# EAGLE design 2019SpaceAppsTrophy (EAGLE 9.5.0)
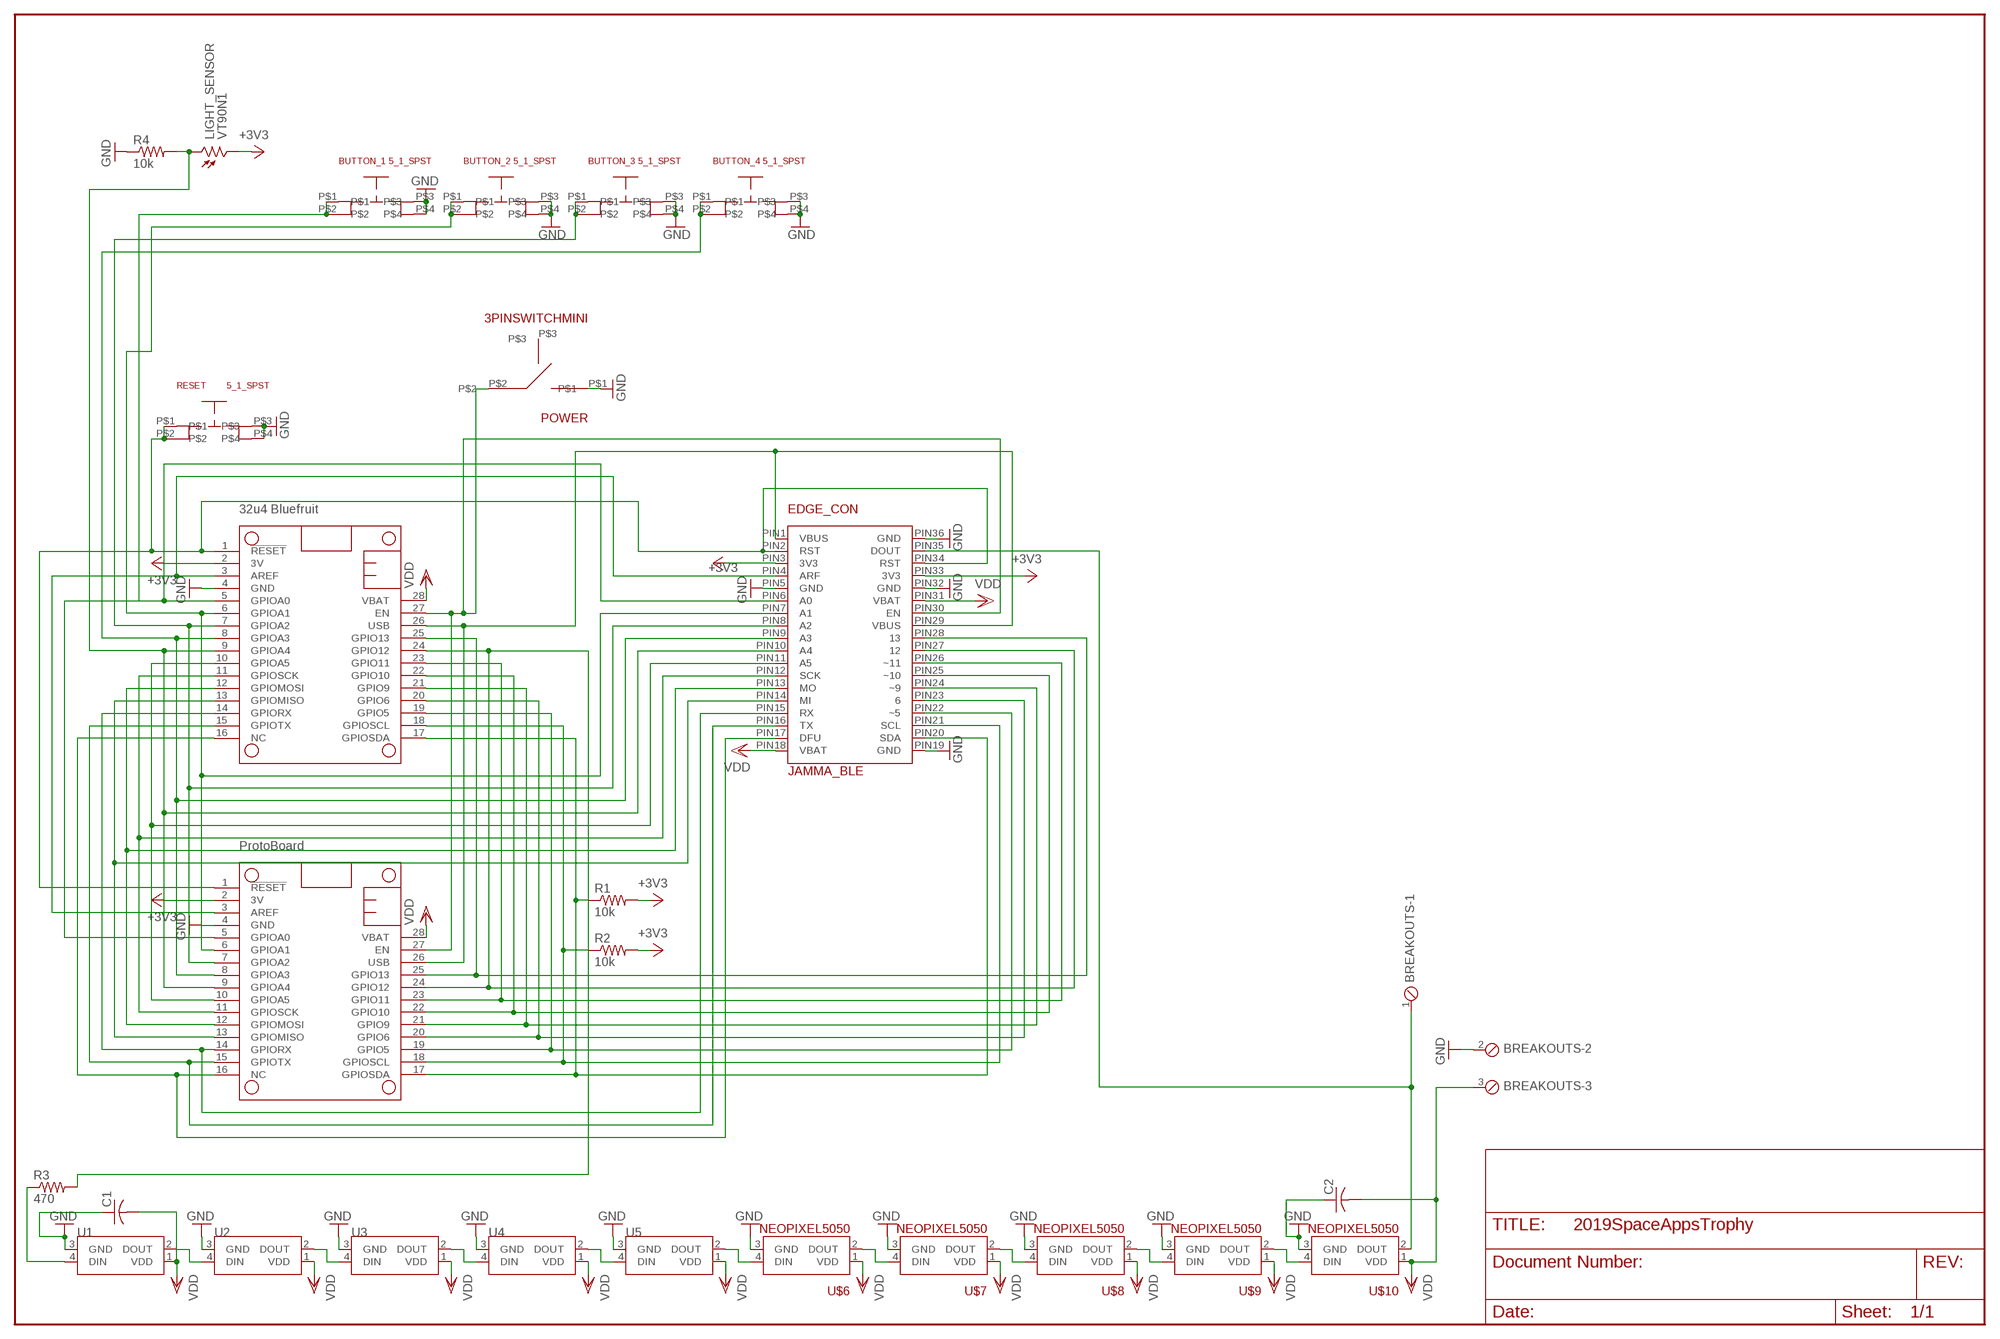
[diagram p0: schematic, sheet 1]

## Parts
BREAKOUTS  MPT3  [3POL254]
BUTTON_1  5_1_SPST  [5_1_SPST]
BUTTON_2  5_1_SPST  [5_1_SPST]
BUTTON_3  5_1_SPST  [5_1_SPST]
BUTTON_4  5_1_SPST  [5_1_SPST]
C1  C-USC0805  [C0805]
C2  C-USC0805  [C0805]
EDGE_CON  JAMMA_BLE  [JAMMA-28/56]
LIGHT_SENSOR  VT90N1  [VT900]
MS2  FEATHERWING  [FEATHERWING]
POWER  3PINSWITCHMINI  [3PINMINI]
PROTOBOARD  FEATHERWING  [FEATHERWING]
R1  10k  R-US_M0805  [M0805]
R2  10k  R-US_M0805  [M0805]
R3  470  R-US_M0805  [M0805]
R4  10k  R-US_M0805  [M0805]
RESET  5_1_SPST  [5_1_SPST]
U$1  NEOPIXEL5050  [NEOPIXEL5050]
U$2  NEOPIXEL5050  [NEOPIXEL5050]
U$3  NEOPIXEL5050  [NEOPIXEL5050]
U$4  NEOPIXEL5050  [NEOPIXEL5050]
U$5  NEOPIXEL5050  [NEOPIXEL5050]
U$6  NEOPIXEL5050  [NEOPIXEL5050]
U$7  NEOPIXEL5050  [NEOPIXEL5050]
U$8  NEOPIXEL5050  [NEOPIXEL5050]
U$9  NEOPIXEL5050  [NEOPIXEL5050]
U$10  NEOPIXEL5050  [NEOPIXEL5050]

## Nets
+3V3 [POWER]: EDGE_CON.PIN3(3V3) EDGE_CON.PIN33(3V3) LIGHT_SENSOR.2 MS2.2(3V) PROTOBOARD.2(3V) R1.2 R2.2
GND [POWER]: BREAKOUTS.2 BUTTON_1.P$3 BUTTON_1.P$4 BUTTON_2.P$3 BUTTON_2.P$4 BUTTON_3.P$3 BUTTON_3.P$4 BUTTON_4.P$3 BUTTON_4.P$4 C1.1 C2.1 EDGE_CON.PIN5(GND) EDGE_CON.PIN19(GND) EDGE_CON.PIN32(GND) EDGE_CON.PIN36(GND) MS2.4(GND) POWER.P$1 PROTOBOARD.4(GND) R4.1 RESET.P$3 RESET.P$4 U$1.3(GND) U$2.3(GND) U$3.3(GND) U$4.3(GND) U$5.3(GND) U$6.3(GND) U$7.3(GND) U$8.3(GND) U$9.3(GND) U$10.3(GND)
N$1: EDGE_CON.PIN17(DFU) MS2.16(NC) PROTOBOARD.16(NC)
N$2: EDGE_CON.PIN16(TX) MS2.15(GPIOTX) PROTOBOARD.15(GPIOTX)
N$3: EDGE_CON.PIN15(RX) MS2.14(GPIORX) PROTOBOARD.14(GPIORX)
N$4: EDGE_CON.PIN14(MI) MS2.13(GPIOMISO) PROTOBOARD.13(GPIOMISO)
N$5: EDGE_CON.PIN13(MO) MS2.12(GPIOMOSI) PROTOBOARD.12(GPIOMOSI)
N$6: U$7.2(DOUT) U$8.4(DIN)
N$7: EDGE_CON.PIN11(A5) MS2.10(GPIOA5) PROTOBOARD.10(GPIOA5)
N$8: EDGE_CON.PIN10(A4) LIGHT_SENSOR.1 MS2.9(GPIOA4) PROTOBOARD.9(GPIOA4) R4.2
N$9: BUTTON_4.P$1 BUTTON_4.P$2 EDGE_CON.PIN9(A3) MS2.8(GPIOA3) PROTOBOARD.8(GPIOA3)
N$10: BUTTON_3.P$1 BUTTON_3.P$2 EDGE_CON.PIN8(A2) MS2.7(GPIOA2) PROTOBOARD.7(GPIOA2)
N$11: BUTTON_2.P$1 BUTTON_2.P$2 EDGE_CON.PIN7(A1) MS2.6(GPIOA1) PROTOBOARD.6(GPIOA1)
N$12: BUTTON_1.P$1 BUTTON_1.P$2 EDGE_CON.PIN6(A0) MS2.5(GPIOA0) PROTOBOARD.5(GPIOA0)
N$13: EDGE_CON.PIN4(ARF) MS2.3(AREF) PROTOBOARD.3(AREF)
N$14: EDGE_CON.PIN2(RST) EDGE_CON.PIN34(RST) MS2.1(!RESET) PROTOBOARD.1(!RESET) RESET.P$1 RESET.P$2
N$15: U$8.2(DOUT) U$9.4(DIN)
N$16: EDGE_CON.PIN28 MS2.25(GPIO13) PROTOBOARD.25(GPIO13)
N$17: EDGE_CON.PIN27 MS2.24(GPIO12) PROTOBOARD.24(GPIO12) R3.2
N$18: EDGE_CON.PIN26(~11) MS2.23(GPIO11) PROTOBOARD.23(GPIO11)
N$19: EDGE_CON.PIN25(~10) MS2.22(GPIO10) PROTOBOARD.22(GPIO10)
N$20: EDGE_CON.PIN24(~9) MS2.21(GPIO9) PROTOBOARD.21(GPIO9)
N$21: EDGE_CON.PIN23 MS2.20(GPIO6) PROTOBOARD.20(GPIO6)
N$22: EDGE_CON.PIN22(~5) MS2.19(GPIO5) PROTOBOARD.19(GPIO5)
N$23: EDGE_CON.PIN21(SCL) MS2.18(GPIOSCL) PROTOBOARD.18(GPIOSCL) R2.1
N$24: EDGE_CON.PIN20(SDA) MS2.17(GPIOSDA) PROTOBOARD.17(GPIOSDA) R1.1
N$25: U$9.2(DOUT) U$10.4(DIN)
N$26: U$1.2(DOUT) U$2.4(DIN)
N$27: U$2.2(DOUT) U$3.4(DIN)
N$28: U$3.2(DOUT) U$4.4(DIN)
N$29: U$4.2(DOUT) U$5.4(DIN)
N$30: U$6.2(DOUT) U$7.4(DIN)
N$31: U$5.2(DOUT) U$6.4(DIN)
N$32: BREAKOUTS.1 EDGE_CON.PIN35(DOUT) U$10.2(DOUT)
N$33: EDGE_CON.PIN12(SCK) MS2.11(GPIOSCK) PROTOBOARD.11(GPIOSCK)
N$34: R3.1 U$1.4(DIN)
N$48: EDGE_CON.PIN30(EN) MS2.27(EN) POWER.P$2 PROTOBOARD.27(EN)
USB [POWER]: EDGE_CON.PIN1(VBUS) EDGE_CON.PIN29(VBUS) MS2.26(USB) PROTOBOARD.26(USB)
VDD [POWER]: BREAKOUTS.3 C1.2 C2.2 EDGE_CON.PIN18(VBAT) EDGE_CON.PIN31(VBAT) MS2.28(VBAT) PROTOBOARD.28(VBAT) U$1.1(VDD) U$2.1(VDD) U$3.1(VDD) U$4.1(VDD) U$5.1(VDD) U$6.1(VDD) U$7.1(VDD) U$8.1(VDD) U$9.1(VDD) U$10.1(VDD)
Unconnected: POWER.P$3

## Notes on the sheet
- 32u4 Bluefruit
- ProtoBoard
- U1 | U2 | U3 | U4 | U5

## Library data of the parts
BREAKOUTS = con-phoenix-254:MPT3: PHOENIX CONNECTOR; OC_FARNELL: unknown; OC_NEWARK: unknown
BUTTON_1-BUTTON_4 RESET = TrophyParts:5_1_SPST
C1 C2 = adafruit:C-US: CAPACITOR, American symbol
EDGE_CON = TrophyParts:JAMMA_BLE
LIGHT_SENSOR = TrophyParts:VT9: Photoconductive Cell VT900 Series Source: http://optoelectronics.perkinelmer.com/content/Datasheets/DTS_vt900seriesdatasheet.pdf
MS2 PROTOBOARD = TrophyParts:FEATHERWING
POWER = TrophyParts:3PINSWITCHMINI
R1-R4 = adafruit:R-US_: RESISTOR, American symbol
U$1-U$10 = TrophyParts:NEOPIXEL5050

## Net classes
1 POWER: width 0.508 mm
2 5V: width 0.508 mm

## Board
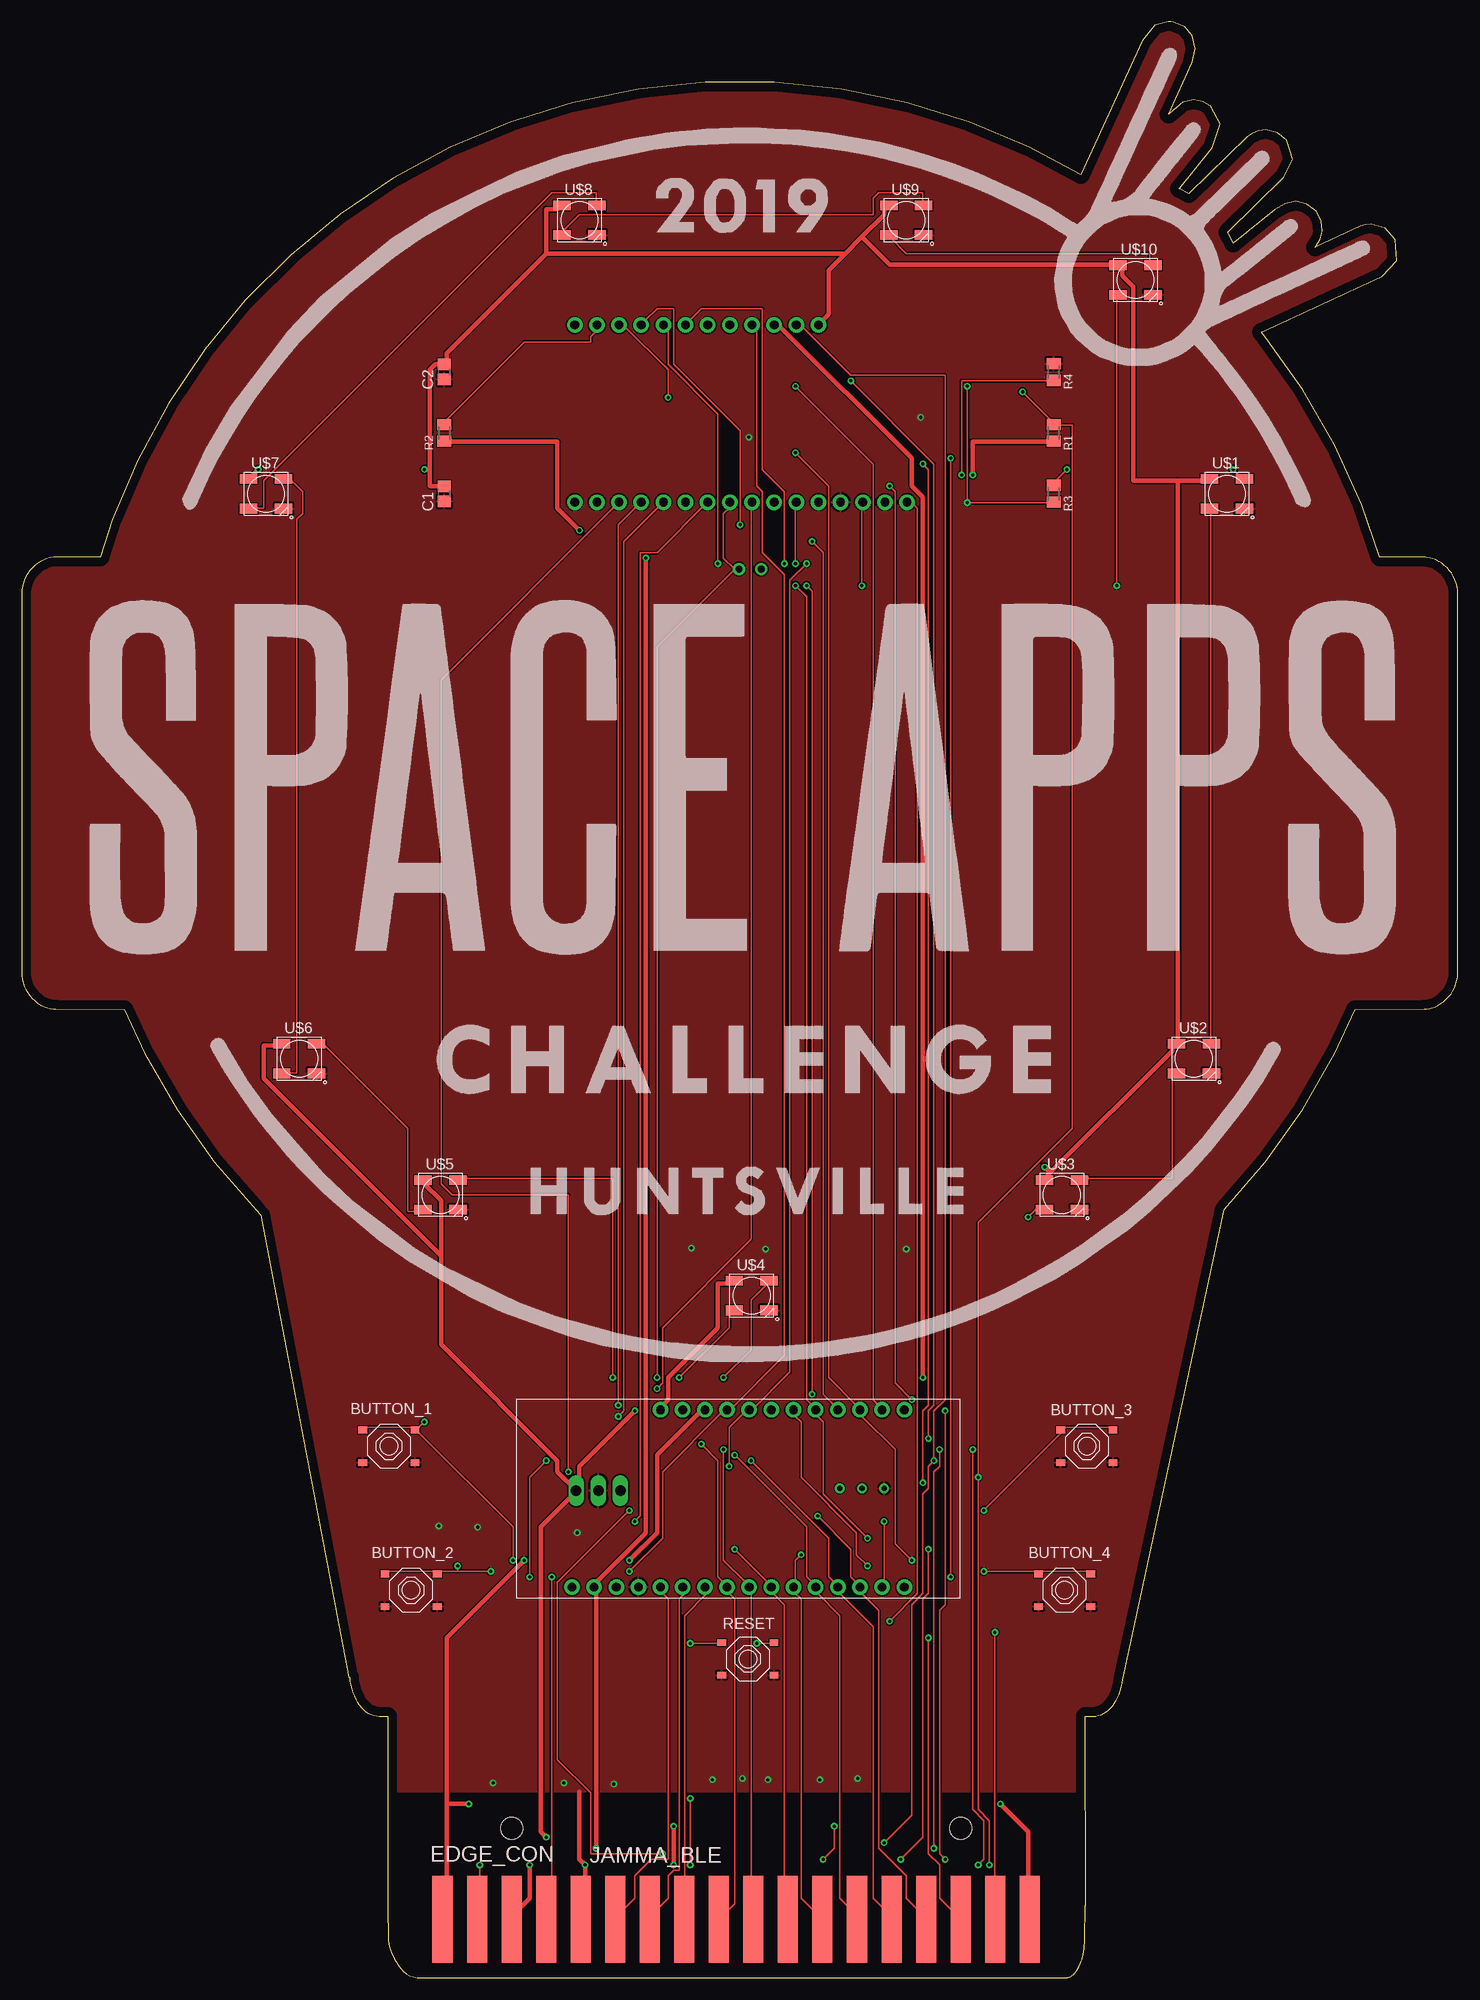
[diagram p1: board, top side]
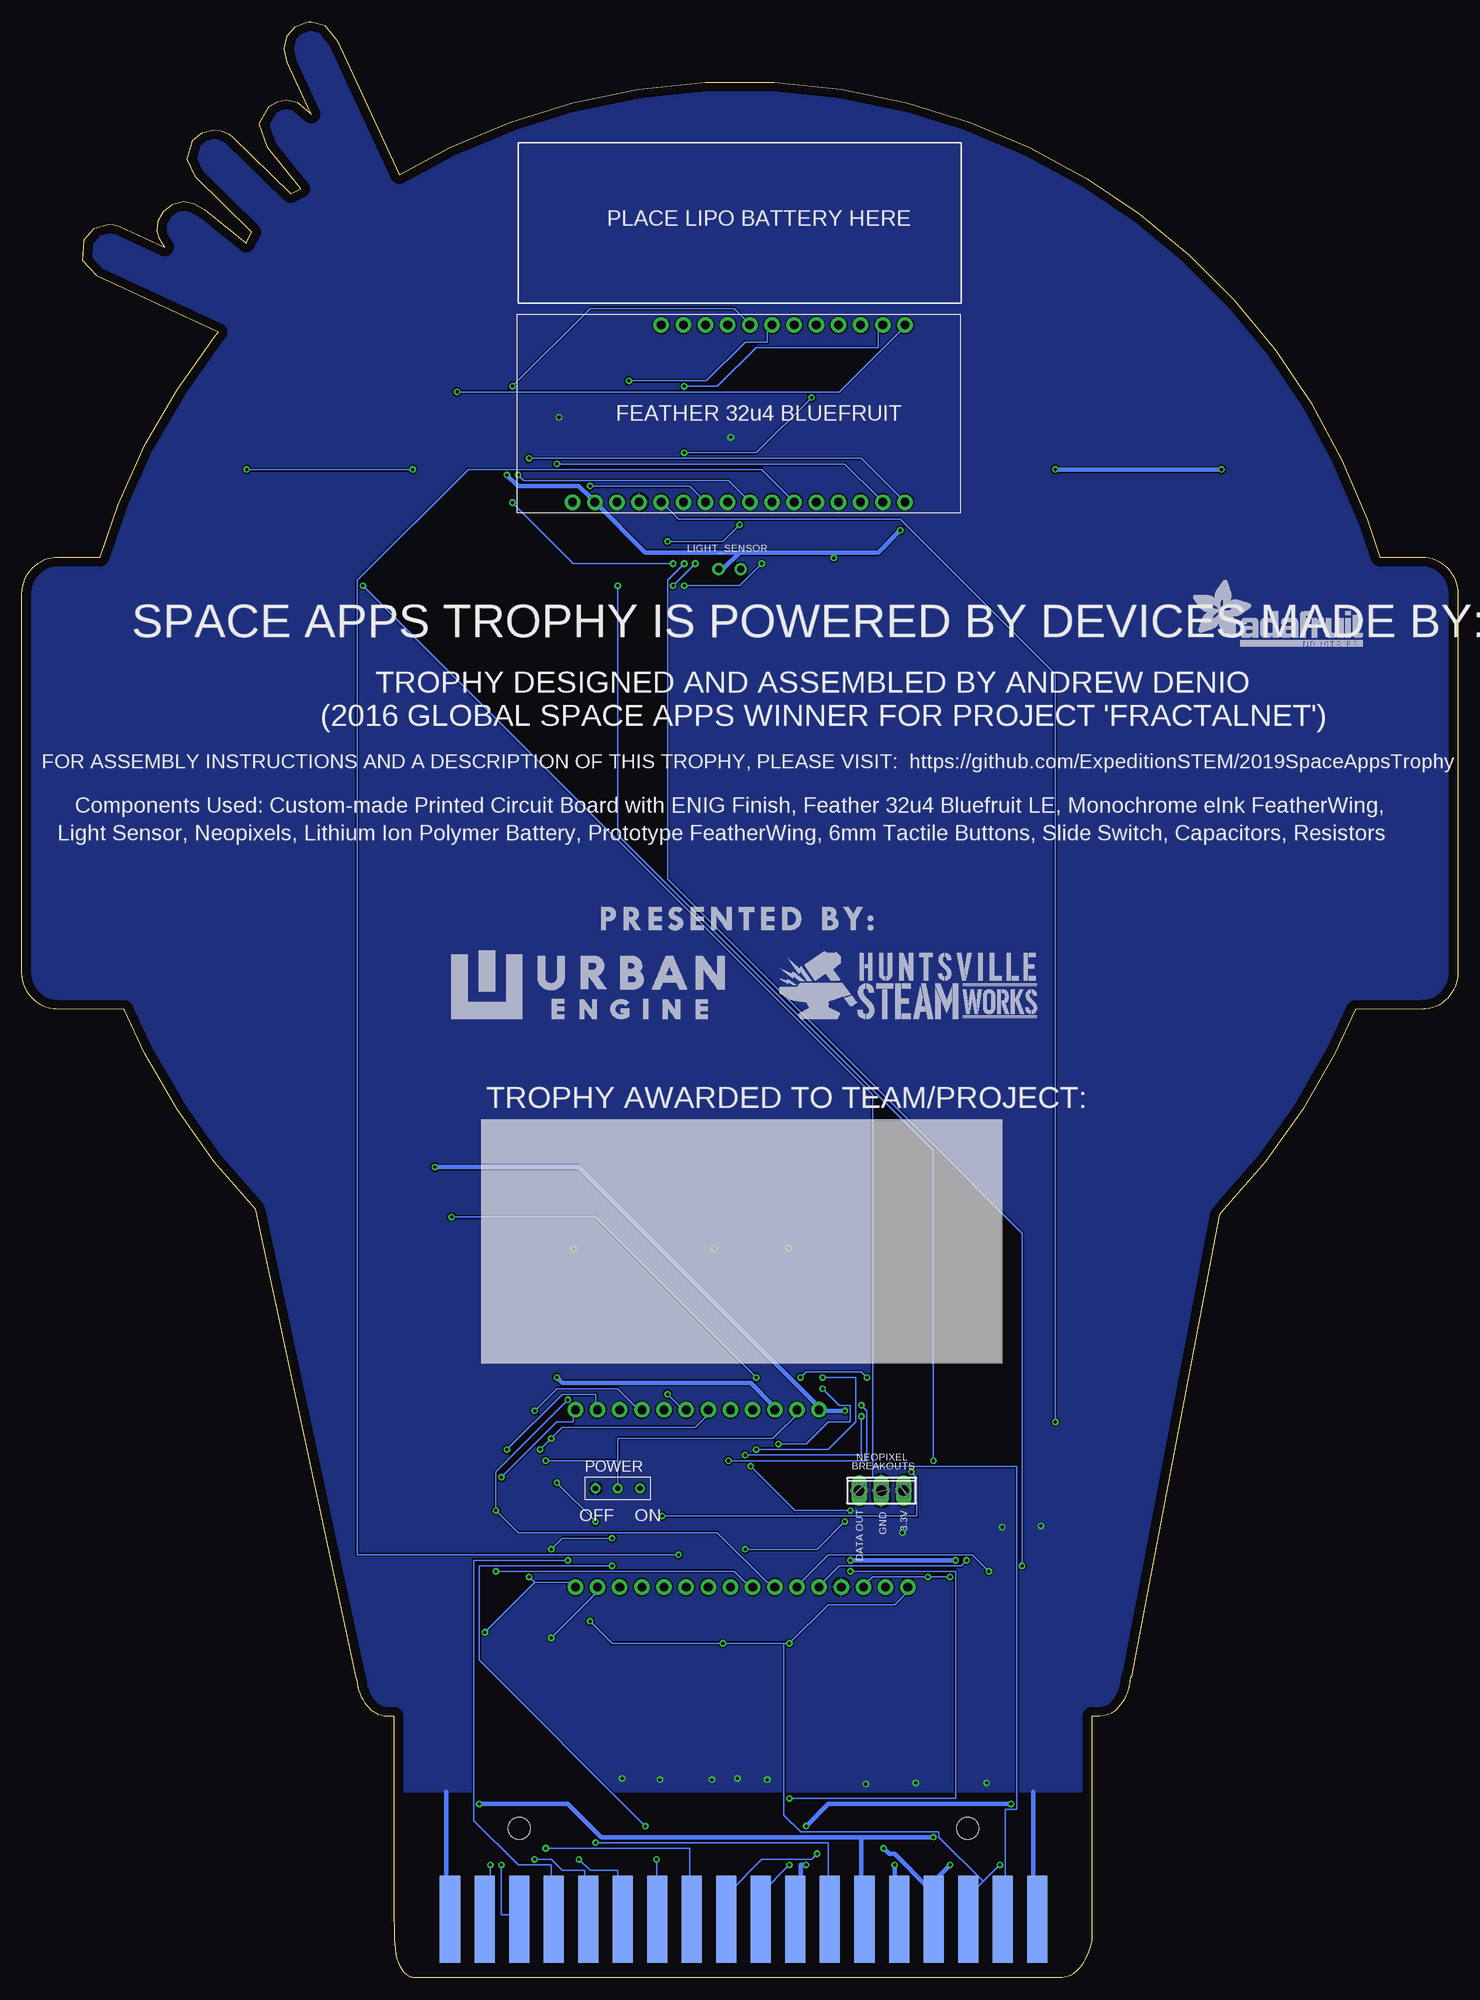
[diagram p2: board, bottom side, seen from below]

Size 164.64 x 224.29 mm. Coordinates in mm from the lower left corner, seen from the top.
Outline: 164.64,158.65 164.61,159.09 164.54,159.52 164.44,159.93 164.29,160.32 164.12,160.7 163.91,161.05 163.67,161.38 163.4,161.68 163.1,161.96 162.78,162.2 162.44,162.41 162.07,162.59 161.69,162.73 161.5,162.78 161.09,162.87 160.89,162.89 160.68,162.9 155.67,162.91 153.59,168.93 150.52,175.71 146.84,182.13 142.57,188.13 142.12,188.68 155.98,195.13 157.63,196.9 157.46,199.29 156.32,200.61 154.69,201.09 154.07,201.03 153.45,200.85 148.26,198.46 148.84,199.34 149.1,200.3 148.97,201.49 148.37,202.56 147.32,203.4 146.05,203.69 144.86,203.45 143.66,202.73 138.89,198.9 138.6,199.53 138.27,200.14 144.69,206.46 145.7,208.52 145.03,210.69 143.95,211.59 142.61,211.91 141.78,211.79 140.98,211.45 140.49,211.11 133.79,204.57 132.67,205.12 136.46,209.87 137.39,212.59 136.28,214.61 135.36,215.14 134.34,215.32 133.07,215.04 131.58,213.82 131.47,213.67 134.21,219.65 134.55,221.21 134.2,222.67 133.3,223.7 132.03,224.23 131.73,224.27 131.43,224.29 129.9,223.88 128.45,222.14 121.39,206.73 115.52,209.88 108.65,212.78 101.46,215.02 93.98,216.55 86.26,217.33 78.38,217.33 70.66,216.55 63.18,215.02 55.99,212.78 49.12,209.88 42.61,206.34 36.5,202.22 30.83,197.54 25.63,192.34 20.95,186.67 16.82,180.56 13.29,174.05 10.38,167.18 8.97,162.91 3.89,162.9 3.68,162.89 3.27,162.82 2.88,162.71 2.5,162.57 2.14,162.39 1.8,162.17 1.48,161.92 1.19,161.64 0.92,161.34 0.68,161.01 0.48,160.65 0.3,160.27 0.16,159.88 0.06,159.46 0,159.04 0,114.92 0.06,114.49 0.16,114.08 0.3,113.68 0.48,113.31 0.68,112.95 0.92,112.62 1.19,112.31 1.48,112.03 1.8,111.79 2.14,111.57 2.5,111.39 2.88,111.24 3.27,111.14 3.68,111.07 3.89,111.06 11.75,111.05 14.11,105.99 17.8,99.57 22.07,93.57 26.88,88.01 27.39,87.5 37.46,34.44 37.57,34.44 37.62,33.98 37.7,33.53 37.8,33.1 37.93,32.69 38.09,32.3 38.27,31.93 38.47,31.59 38.69,31.27 38.93,30.98 39.18,30.73 39.45,30.51 39.74,30.32 40.04,30.18 40.35,30.07 40.67,30 41,29.98 41.34,29.98 41.34,29.96 41.95,29.96 41.96,8.31 41.98,8.31 41.99,4.22 42.15,3.59 42.37,2.94 42.7,2.19 42.91,1.81 43.15,1.43 43.42,1.07 43.73,0.75 44.08,0.47 44.46,0.24 44.88,0.08 45.35,0 119.75,0 119.77,0 119.83,0.01 119.92,0.03 120.04,0.07 120.19,0.14 120.35,0.23 120.53,0.36 120.71,0.53 120.9,0.74 121.08,1.01 121.26,1.33 121.42,1.72 121.57,2.17 121.69,2.7 121.79,3.31 121.87,4.27 121.94,8.31 121.95,8.31 121.94,29.96 122.72,29.96 122.72,29.98 122.8,29.98 123.12,30 123.43,30.06 123.73,30.16 124.02,30.3 124.3,30.47 124.56,30.68 124.81,30.92 125.05,31.19 125.27,31.48 125.46,31.8 125.64,32.15 125.8,32.52 125.94,32.91 126.05,33.32 126.14,33.74 126.2,34.18 126.22,34.18 137.83,88.09 142.57,93.57 146.84,99.57 150.52,105.99 152.89,111.05 160.78,111.06 160.99,111.08 161.4,111.15 161.6,111.2 161.98,111.33 162.35,111.5 162.7,111.7 163.02,111.94 163.32,112.2 163.6,112.5 163.85,112.82 164.07,113.17 164.25,113.54 164.41,113.93 164.52,114.34 164.6,114.76 164.64,115.19 164.64,158.65
Copper layers (1*16): Top 0.035mm / dielectric 1.5mm / Bottom 0.035mm
Design rules "default *": minimum track width 6mil, minimum drill 0.35mm, track to track 6mil, track to pad 6mil, pad to pad 6mil, via to via 6mil, smd to smd 6mil, copper to edge 40mil, drill to drill 6mil, minimum pad ring 10mil, minimum via ring 8mil, stop-mask expansion 4mil, vias tented up to drill 15mil, thermal gap 10mil
Holes 2.54 mm at 56.19,17.13 107.62,17.13
vRestrict: area 51.9,69.5 to 112.8,99.3; area 44.9,98 to 119.8,116.4; area 72.2,199 to 93.1,206.6; area 118.5,68.8 to 131.9,81.5; area 34.7,69.5 to 46.2,79.6; area 20.1,70.1 to 145.8,109.5; area 6.8,166 to 102,244.2; area 54.4,15.5 to 58.2,18.7; area 105.8,14.8 to 109.7,18.7; area 45.5,0.2 to 117.9,12.3; area 4.9,115.8 to 160.5,159; area 91.9,183.8 to 159.8,229.5; area 131.9,164.1 to 157.3,191.4; area 137.6,171.7 to 150.9,187.6

### Footprints (pad centres in the part's own frame; a part is rotated, then mirrored left to right if it is on the bottom)
3POL254 = drill 1.2 long: 1 -2.54,0; 2 0,0; 3 2.54,0
5_1_SPST = smd 1 x 0.75: P$1 -3,1.875; P$2 3,1.875; P$3 -3,-1.875; P$4 3,-1.875
C0805 = smd 1.3 x 1.5: 1 -0.85,0; 2 0.85,0
JAMMA-28/56 = smd 2.3 x 10: PIN1 2.71,6.73; PIN2 6.67,6.73; PIN3 10.63,6.73; PIN4 14.59,6.73; PIN5 18.55,6.73; PIN6 22.51,6.73; PIN7 26.47,6.73; PIN8 30.43,6.73; PIN9 34.39,6.73; PIN10 38.35,6.73; PIN11 42.31,6.73; PIN12 46.27,6.73; PIN13 50.23,6.73; PIN14 54.19,6.73; PIN15 58.15,6.73; PIN16 62.11,6.73; PIN17 66.07,6.73; PIN18 70.03,6.73 | smd 2.3 x 10 bottom: PIN19 70.03,6.73; PIN20 66.07,6.73; PIN21 62.11,6.73; PIN22 58.15,6.73; PIN23 54.19,6.73; PIN24 50.23,6.73; PIN25 46.27,6.73; PIN26 42.31,6.73; PIN27 38.35,6.73; PIN28 34.39,6.73; PIN29 30.43,6.73; PIN30 26.47,6.73; PIN31 22.51,6.73; PIN32 18.55,6.73; PIN33 14.59,6.73; PIN34 10.63,6.73; PIN35 6.67,6.73; PIN36 2.71,6.73
VT900 = drill 0.8 pad 1.4: 1 -1.27,0; 2 1.27,0
FEATHERWING = drill 1 pad 1.778: 1 6.35,1.27; 2 8.89,1.27; 3 11.43,1.27; 4 13.97,1.27; 5 16.51,1.27; 6 19.05,1.27; 7 21.59,1.27; 8 24.13,1.27; 9 26.67,1.27; 10 29.21,1.27; 11 31.75,1.27; 12 34.29,1.27; 13 36.83,1.27; 14 39.37,1.27; 15 41.91,1.27; 16 44.45,1.27; 17 44.45,21.59; 18 41.91,21.59; 19 39.37,21.59; 20 36.83,21.59; 21 34.29,21.59; 22 31.75,21.59; 23 29.21,21.59; 24 26.67,21.59; 25 24.13,21.59; 26 21.59,21.59; 27 19.05,21.59; 28 16.51,21.59
3PINMINI = drill 0.6: P$1 1.27,3.81; P$2 3.81,3.81; P$3 6.35,3.81
M0805 = smd 1.3 x 1.6: 1 -0.95,0; 2 0.95,0
NEOPIXEL5050 = smd 2 x 1.1: 1 -2,1.7; 2 -2,-1.7; 3 2,-1.7; 4 2,1.7

### Placement (x,y rotation side)
BREAKOUTS  66.09,55.86 0 bottom
BUTTON_1  42.09,60.94 0 top
BUTTON_2  44.63,44.43 0 top
BUTTON_3  122.1,60.94 0 top
BUTTON_4  119.56,44.43 0 top
C1  48.44,170.16 90 top
C2  48.44,184.13 90 top
EDGE_CON  45.52,-0.02 0 top
LIGHT_SENSOR  83.49,161.53 180 bottom
MS2  107.84,167.93 0 bottom
POWER  100.13,52.31 0 bottom
PROTOBOARD  56.72,43.53 0 top
R1  118.29,177.15 270 top
R2  48.44,177.15 270 top
R3  118.29,170.16 270 top
R4  118.29,184.13 270 top
RESET  83.24,36.56 0 top
U$1  138.16,170.16 0 top
U$2  134.37,105.39 0 top
U$3  119.24,89.77 0 top
U$4  83.68,78.21 0 top
U$5  48.01,89.77 0 top
U$6  31.8,105.39 0 top
U$7  27.99,170.16 0 top
U$8  63.93,201.53 0 top
U$9  101.4,201.53 0 top
U$10  127.69,194.67 0 top
U$28  [ADAFRUIT_TEXT_20MM]  30.5,152.66 0 bottom

### Tracks (layer width: path | path; a pad name or v marks a point on that pad's centre or on a via)
+3V3  (via drill 0.35)
  Top 0.508: v65.84,14.84 65.84,44.69 PROTOBOARD.2 65.84,45.32 71.55,51.04 v71.55,162.8 | v58.22,12.94 58.22,9.13 56.31,7.22 EDGE_CON.PIN3 | v109.02,172.32 109.02,176.13 117.91,176.13 R1.2 | v63.93,165.97 61.39,168.51 61.39,176.13 48.69,176.13 R2.2
  Bottom 0.508: v65.84,14.84 65.2,14.21 64.57,14.21 60.76,10.4 | 60.76,10.4 60.12,9.76 60.12,7.22 EDGE_CON.PIN33 60.76,10.4 | 60.76,10.4 v58.22,12.94 | v109.02,172.32 107.75,171.05 100.76,171.05 99.49,169.78 MS2.2 98.86,169.15 93.14,163.43 82.35,163.43 | v63.93,165.97 66.47,163.43 71.55,163.43 | 82.35,163.43 71.55,163.43 | 82.35,163.43 84.25,161.53 LIGHT_SENSOR.2 | 71.55,163.43 v71.55,162.8
GND  (via drill 0.35)
  Top 0.508: EDGE_CON.PIN32 64.57,7.22 v64.57,12.94 63.93,13.57 63.93,21.32
  Bottom 0.508: v64.57,12.94 64.57,7.22 EDGE_CON.PIN32 | 48.69,21.32 48.69,7.22 EDGE_CON.PIN36 | 116,21.32 116,7.22 EDGE_CON.PIN19
  other vias: 63.68,51.04 47.8,51.8 52.25,51.67 62.16,22.33 67.87,22.21 54.03,22.33 76.76,83.68 101.4,83.55 82.6,22.84 91.49,22.72 95.81,22.84 83.36,176.64 103.05,178.93 79.17,22.72 85.52,22.72 85.27,83.55
  pour Top: -9.98,238.74 -9.98,21.32 194.49,21.32 194.49,238.74
  pour Bottom: -15.06,242.55 -15.06,21.32 204.65,21.32 204.65,242.55
N$1  (via drill 0.35)
  Top 0.152: v106.48,45.96 v106.48,174.23 | v111.56,39.61 111.56,7.22 EDGE_CON.PIN17
  Bottom 0.152: v106.48,174.23 68.38,174.23 63.93,169.78 MS2.16 | 105.84,45.32 v106.48,45.96 | 105.84,45.32 101.4,45.32 PROTOBOARD.16 | 105.84,45.32 v111.56,39.61
N$2  (via drill 0.35)
  Top 0.152: v103.3,173.59 103.94,172.96 103.94,65.64 103.3,65.01 v103.3,56.75 | v98.86,52.31 98.86,45.32 PROTOBOARD.15 | v103.94,38.97 103.94,14.21 105.21,12.94 105.21,9.13 107.11,7.22 EDGE_CON.PIN16
  Bottom 0.152: v103.3,173.59 70.28,173.59 66.47,169.78 MS2.15 | v98.86,52.31 v103.3,56.75 | v103.94,38.97 98.22,44.69 PROTOBOARD.15
N$3  (via drill 0.35)
  Top 0.152: v62.66,58.02 62.66,89.77 49.33,89.77 48.06,91.04 48.06,148.83 68.38,169.15 MS2.14 | v91.24,52.94 95.05,49.13 95.05,45.96 95.68,45.32 PROTOBOARD.14 96.32,44.69 96.32,44.05 98.22,42.15 98.22,14.84 101.4,11.67 101.4,9.13 103.3,7.22 EDGE_CON.PIN15
  Bottom 0.152: v62.66,58.02 62.03,57.39 62.03,52.94 v91.24,52.94
N$4  (via drill 0.35)
  Top 0.152: v68.38,65.64 68.38,166.61 70.92,169.15 MS2.13 | v83.62,59.29 92.51,50.4 92.51,45.96 93.14,45.32 PROTOBOARD.13 93.78,44.69 93.78,44.05 97.59,40.24 97.59,9.13 99.49,7.22 EDGE_CON.PIN14
  Bottom 0.152: v68.38,65.64 67.74,65.01 67.74,59.29 v83.62,59.29
N$5  (via drill 0.35)
  Top 0.152: v68.38,64.37 69.01,65.01 69.01,164.7 73.46,169.15 MS2.12 | v81.71,59.93 89.97,51.67 89.97,45.96 90.6,45.32 PROTOBOARD.12 91.24,44.69 91.24,44.05 93.78,41.51 93.78,9.13 95.68,7.22 EDGE_CON.PIN13
  Bottom 0.152: v68.38,64.37 68.38,59.93 v81.71,59.93
N$6
  Top 0.152: U$7.2 26.47,168.51 27.74,168.51 27.74,171.69 60.76,204.71 65.84,204.71 65.84,203.44 U$8.4
N$7  (via drill 0.35)
  Top 0.152: v70.28,52.31 70.92,52.94 70.92,163.43 72.82,163.43 78.54,169.15 MS2.10 | v81.71,49.13 85.52,45.32 PROTOBOARD.10 86.16,44.69 86.16,44.05 87.43,42.78 87.43,7.22 EDGE_CON.PIN11
  Bottom 0.152: v70.28,52.31 73.46,49.13 v81.71,49.13
N$8  (via drill 0.35)
  Top 0.152: EDGE_CON.PIN10 83.62,7.22 83.62,44.69 PROTOBOARD.9 82.98,45.32 80.44,47.86 v80.44,60.56 | v107.75,172.32 107.75,183.12 117.91,183.12 R4.2 | 81.71,161.53 80.44,162.8 80.44,167.88 81.08,168.51 81.08,169.15 MS2.9 | v72.82,68.82 72.82,152.64 81.71,161.53 | 81.71,161.53 LIGHT_SENSOR.1
  Bottom 0.152: v107.75,172.32 107.11,171.69 83.62,171.69 81.71,169.78 MS2.9 | v80.44,60.56 72.19,60.56 69.01,63.74 69.01,68.82 v72.82,68.82
N$9  (via drill 0.35)
  Top 0.152: 116.64,46.59 122.35,46.59 BUTTON_4.P$2 | v110.29,46.59 116.64,46.59 | 116.64,46.59 BUTTON_4.P$1 | v72.82,67.55 73.46,68.18 73.46,74.53 83.62,84.69 83.62,169.15 MS2.8 | v77.9,61.2 79.81,59.29 79.81,45.96 80.44,45.32 PROTOBOARD.8 81.08,44.69 81.08,44.05 81.71,43.42 81.71,8.49 80.44,7.22 EDGE_CON.PIN9
  Bottom 0.152: v110.29,46.59 82.98,46.59 81.71,45.32 81.08,45.32 PROTOBOARD.8 | v72.82,67.55 70.92,65.64 69.65,65.64 69.65,63.74 72.19,63.74 74.73,61.2 v77.9,61.2
N$10  (via drill 0.35)
  Top 0.152: BUTTON_3.P$2 124.89,63.1 119.18,63.1 BUTTON_3.P$1 119.18,62.47 v110.29,53.58 | v99.49,171.05 100.13,170.42 100.13,68.18 v102.03,66.28 | EDGE_CON.PIN8 76,7.22 76,41.51 78.54,44.05 78.54,44.69 PROTOBOARD.7
  Bottom 0.152: PROTOBOARD.7 78.54,45.32 79.17,45.32 84.89,51.04 107.75,51.04 v110.29,53.58 110.29,58.02 v102.03,66.28 | v99.49,171.05 88.06,171.05 86.79,169.78 MS2.7
N$11  (via drill 0.35)
  Top 0.152: BUTTON_2.P$1 41.71,46.59 47.42,46.59 BUTTON_2.P$2 48.06,46.59 49.96,46.59 | v53.77,46.59 49.96,46.59 | v88.7,162.16 88.7,169.15 MS2.6 | 49.96,46.59 v49.96,47.23 | EDGE_CON.PIN7 72.19,7.22 74.09,9.13 74.09,11.67 74.73,12.3 75.36,12.3 75.36,43.42 76,44.05 76,44.69 PROTOBOARD.6
  Bottom 0.152: v53.77,46.59 55.68,48.5 72.19,48.5 75.36,45.32 PROTOBOARD.6 | v88.7,162.16 90.6,160.26 90.6,125.97 49.96,85.33 v49.96,47.23
N$12  (via drill 0.35)
  Top 0.152: BUTTON_1.P$1 39.17,63.1 44.88,63.1 BUTTON_1.P$2 | v56.31,47.86 56.31,51.67 45.52,62.47 BUTTON_1.P$2 | v46.15,63.74 45.52,63.1 BUTTON_1.P$2 | EDGE_CON.PIN6 68.38,7.22 70.28,9.13 70.28,11.67 72.19,13.57 74.09,13.57 74.09,43.42 73.46,44.05 73.46,44.69 PROTOBOARD.5
  Bottom 0.152: v56.31,47.86 56.95,47.23 70.92,47.23 72.82,45.32 PROTOBOARD.5 | v46.15,63.74 46.15,149.46 63.93,167.24 89.33,167.24 91.24,169.15 MS2.5
N$13  (via drill 0.35)
  Top 0.152: v60.76,45.96 60.76,7.86 60.12,7.22 EDGE_CON.PIN4 | v96.32,159.62 96.32,169.15 MS2.3 | v60.12,59.29 58.22,57.39 v58.22,45.96
  Bottom 0.152: PROTOBOARD.3 67.74,45.32 67.11,45.96 v60.76,45.96 v58.22,45.96 | v96.32,159.62 96.32,131.05 60.12,94.85 v60.12,59.29
N$14  (via drill 0.35)
  Top 0.152: v52.5,12.94 52.5,7.22 EDGE_CON.PIN2 | v76.63,38.34 79.81,38.34 RESET.P$1 | v84.25,38.34 86.16,38.34 RESET.P$2 | v99.49,40.88 102.67,44.05 102.67,168.51 102.03,169.15 MS2.1
  Bottom 0.152: 54.41,11.03 55.68,9.76 55.68,7.22 EDGE_CON.PIN34 | 54.41,11.03 v52.5,12.94 | PROTOBOARD.1 62.66,44.69 64.57,42.78 72.19,42.78 v76.63,38.34 77.27,38.34 | 77.27,38.34 v84.25,38.34 96.95,38.34 v99.49,40.88 | 54.41,11.03 59.49,16.11 59.49,16.75 75.36,16.75 77.27,18.65 77.27,38.34
N$15
  Top 0.152: U$8.2 62.03,200.26 63.93,202.17 97.59,202.17 97.59,204.07 98.22,204.71 103.3,204.71 103.3,203.44 U$9.4
N$16  (via drill 0.35)
  Top 0.152: v69.65,46.59 73.46,50.4 73.46,58.02 80.44,65.01 PROTOBOARD.25 81.08,65.01 87.43,71.36 87.43,160.89 84.89,163.43 84.89,170.42 84.25,171.05 84.25,189.47 MS2.25 | v76.63,12.94 v76.63,20.56
  Bottom 0.152: v69.65,46.59 57.58,46.59 57.58,20.56 v76.63,20.56 | v76.63,12.94 79.81,9.76 79.81,7.22 EDGE_CON.PIN28
N$17  (via drill 0.35)
  Top 0.152: v108.38,182.48 v108.38,169.15 117.91,169.15 R3.2 | v81.08,58.66 81.08,63.1 82.98,65.01 PROTOBOARD.24 83.62,65.01 88.06,69.45 88.06,160.26 v89.97,162.16 | v69.65,53.58 61.39,45.32 61.39,25 65.2,21.19 65.2,14.21 v73.46,14.21
  Bottom 0.152: v108.38,182.48 99.49,191.37 82.98,191.37 81.71,190.1 MS2.24 | v81.08,58.66 76,53.58 v69.65,53.58 | v73.46,14.21 74.09,13.57 79.81,13.57 83.62,9.76 83.62,7.22 EDGE_CON.PIN27 | v108.38,169.15 101.4,162.16 v89.97,162.16
N$18  (via drill 0.35)
  Top 0.152: v95.05,183.12 104.57,173.59 104.57,65.64 103.94,65.01 v103.94,61.83 | v104.57,14.84 104.57,58.02 105.21,58.66 v105.21,60.56
  Bottom 0.152: v95.05,183.12 86.16,183.12 81.71,187.56 79.17,187.56 79.17,189.47 MS2.23 | PROTOBOARD.23 85.52,65.01 87.43,63.1 102.67,63.1 v103.94,61.83 v105.21,60.56 | v104.57,14.84 88.06,14.84 88.06,7.22 EDGE_CON.PIN26
N$19  (via drill 0.35)
  Top 0.152: v87.43,162.16 87.43,170.42 84.89,172.96 84.89,191.37 77.9,191.37 76.63,190.1 MS2.22 | v89.97,159.62 90.6,158.99 v90.6,66.91 | v91.87,13.57 93.14,14.84 v93.14,17.38 | v96.95,47.23 95.68,48.5 95.68,51.04 89.33,57.39 89.33,63.74 88.7,64.37 88.7,65.01 PROTOBOARD.22
  Bottom 0.152: v89.97,159.62 v87.43,162.16 | v90.6,66.91 89.33,65.64 88.7,65.64 PROTOBOARD.22 | v91.87,13.57 91.87,7.22 EDGE_CON.PIN25 | v93.14,17.38 112.19,36.43 112.19,47.23 v96.95,47.23
N$20  (via drill 0.35)
  Top 0.152: v79.81,162.16 79.81,179.31 74.09,185.02 74.09,189.47 MS2.21 | v88.7,159.62 89.97,158.35 89.97,66.28 90.6,65.64 PROTOBOARD.21 91.24,65.01 91.24,64.37 91.87,63.74 91.87,55.48 v96.95,50.4 | v100.76,13.57 103.3,16.11 103.3,43.42 103.94,44.05 v103.94,49.13
  Bottom 0.152: v79.81,162.16 82.35,159.62 v88.7,159.62 | v100.76,13.57 99.49,12.3 96.32,12.3 96.32,7.22 EDGE_CON.PIN24 | v103.94,49.13 102.67,50.4 v96.95,50.4
N$21  (via drill 0.35)
  Top 0.152: v82.35,166.61 82.35,177.4 74.73,185.02 74.73,191.37 72.82,191.37 71.55,190.1 MS2.20 | v90.6,164.7 91.87,163.43 91.87,66.91 93.14,65.64 PROTOBOARD.20 | v105.84,13.57 105.21,14.21 105.21,42.15 105.84,42.78 v105.84,65.01
  Bottom 0.152: v82.35,166.61 84.25,164.7 v90.6,164.7 | v105.84,13.57 103.94,13.57 102.67,12.3 100.13,12.3 100.13,7.22 EDGE_CON.PIN23 | v105.84,65.01 103.3,67.55 96.32,67.55 94.41,65.64 93.78,65.64 PROTOBOARD.20
N$22  (via drill 0.35)
  Top 0.152: v74.09,181.21 74.09,184.39 69.01,189.47 MS2.19 | v88.7,174.86 92.51,171.05 92.51,68.82 95.68,65.64 PROTOBOARD.19 96.32,65.01 96.32,64.37 100.13,60.56 100.13,49.77 v102.03,47.86
  Bottom 0.152: v74.09,181.21 80.44,174.86 v88.7,174.86 | v102.03,47.86 112.83,47.86 112.83,18.02 107.75,12.94 103.94,12.94 103.94,7.22 EDGE_CON.PIN22
N$23  (via drill 0.35)
  Top 0.152: R2.1 48.69,178.67 57.58,187.56 65.2,187.56 65.2,188.2 65.84,188.83 65.84,189.47 MS2.18 | v109.02,60.56 109.02,19.29 110.29,18.02 110.29,13.57 v109.65,12.94 | v88.7,182.48 97.59,173.59 97.59,66.28 98.22,65.64 PROTOBOARD.18
  Bottom 0.152: v109.02,60.56 102.67,66.91 98.86,66.91 98.86,65.64 PROTOBOARD.18 | v109.65,12.94 109.65,7.22 107.75,7.22 EDGE_CON.PIN21 | v88.7,182.48 84.89,182.48 80.44,186.93 66.47,186.93 66.47,189.47 MS2.18
N$24  (via drill 0.35)
  Top 0.152: v114.73,181.85 117.91,178.67 R1.1 118.54,178.04 120.45,178.04 120.45,97.39 109.65,86.6 v109.65,57.39 109.65,19.29 110.92,18.02 v110.92,12.94
  Bottom 0.152: v114.73,181.85 70.92,181.85 63.3,189.47 MS2.17 | v109.65,57.39 103.3,63.74 101.4,63.74 101.4,65.01 PROTOBOARD.17 | v110.92,12.94 110.92,7.22 111.56,7.22 EDGE_CON.PIN20
N$25
  Top 0.152: U$9.2 99.49,199.63 101.4,197.72 129.34,197.72 129.34,196.45 U$10.4
N$26
  Top 0.152: U$1.2 136.32,168.51 136.32,107.55 U$2.4
N$27
  Top 0.152: U$3.4 121.72,91.68 131.88,91.68 131.88,103.74 U$2.2
N$28  (via drill 0.35)
  Top 0.152: v80.44,68.82 83.62,71.99 83.62,77.71 85.52,79.61 U$4.4 | v115.37,87.23 116.64,88.5 U$3.2
  Bottom 0.152: v80.44,68.82 98.86,87.23 v115.37,87.23
N$29  (via drill 0.35)
  Top 0.152: v67.74,68.82 67.74,91.68 50.6,91.68 U$5.4 | v75.36,68.82 81.08,74.53 81.08,76.44 U$4.2
  Bottom 0.152: v67.74,68.82 68.38,69.45 74.73,69.45 v75.36,68.82
N$30
  Top 0.152: U$6.2 30.28,103.74 31.55,103.74 31.55,167.24 32.18,167.88 32.18,170.42 30.28,172.32 U$7.4
N$31
  Top 0.152: U$5.2 45.52,87.87 44.25,87.87 44.25,97.39 34.09,107.55 U$6.4
N$32  (via drill 0.35)
  Top 0.152: v125.53,159.62 125.53,192.64 U$10.2
  Bottom 0.152: v125.53,159.62 67.11,101.2 67.11,58.66 | 67.11,58.66 67.11,57.39 67.74,57.39 69.01,56.12 BREAKOUTS.1 | 67.11,58.66 50.6,58.66 50.6,19.29 51.87,19.29 51.87,7.22 EDGE_CON.PIN35
N$33  (via drill 0.35)
  Top 0.152: v89.33,48.5 88.7,47.86 88.7,45.32 PROTOBOARD.11 88.7,44.69 88.7,44.05 89.33,43.42 89.33,9.13 91.24,7.22 EDGE_CON.PIN12
  Bottom 0.152: v89.33,48.5 126.16,48.5 126.16,160.26 113.46,172.96 79.81,172.96 76.63,169.78 MS2.11
N$34  (via drill 0.35)
  Top 0.152: v119.81,172.96 118.54,171.69 R3.1 | v138.86,172.96 140.13,171.69 U$1.4
  Bottom 0.152: v138.86,172.96 v119.81,172.96
N$48  (via drill 0.35)
  Top 0.152: MS2.27 89.33,189.47 95.05,183.75 105.84,183.75 105.84,66.28 104.57,65.01 v104.57,59.29 103.94,58.66 103.94,56.12 103.3,55.48 103.3,44.05 102.03,42.78 102.03,18.65 v98.86,15.48
  Bottom 0.152: 96.32,59.29 96.32,61.83 78.54,61.83 75.36,65.01 PROTOBOARD.27 | 96.32,59.29 POWER.P$2 | 96.32,59.29 v104.57,59.29 | v98.86,15.48 72.19,15.48 72.19,7.22 EDGE_CON.PIN30
USB  (via drill 0.35)
  Top 0.508: v69.65,47.86 72.82,51.04 72.82,59.93 77.9,65.01 PROTOBOARD.26 | v57.58,47.86 48.69,38.97 48.69,19.92 | 48.69,19.92 48.69,7.22 EDGE_CON.PIN1 | v103.3,68.82 103.3,169.78 102.03,171.05 102.03,174.23 86.79,189.47 MS2.26 | v74.73,17.38 v74.73,12.94 | 48.69,19.92 v51.23,19.92
  Bottom 0.508: v57.58,47.86 v69.65,47.86 | v103.3,68.82 102.67,68.18 81.08,68.18 78.54,65.64 PROTOBOARD.26 | v74.73,12.94 75.36,12.94 75.36,7.22 EDGE_CON.PIN29 | v74.73,17.38 72.19,19.92 v51.23,19.92
VDD  (via drill 0.35)
  Top 0.508: v112.19,19.92 115.37,16.75 115.37,7.22 EDGE_CON.PIN18 | U$4.1 81.08,79.61 79.81,79.61 79.81,74.53 74.09,68.82 74.09,66.28 73.46,65.64 PROTOBOARD.28 | 48.06,82.79 48.06,72.63 61.39,59.29 61.39,58.02 BREAKOUTS.3 | 48.06,82.79 48.06,89.14 46.15,91.04 U$5.1 | 48.06,82.79 27.74,103.11 27.74,106.92 29.64,106.92 U$6.1 | v70.28,65.01 63.93,58.66 63.93,56.12 BREAKOUTS.3 | v60.12,16.11 59.49,16.75 59.49,51.67 63.3,55.48 BREAKOUTS.3 | 46.79,172.96 46.79,184.39 47.42,185.02 48.06,185.02 C2.2 48.69,185.02 48.69,186.29 60.12,197.72 | 46.79,172.96 46.79,171.05 48.06,171.05 C1.2 | v27.1,172.96 26.47,172.32 U$7.1 | 46.79,172.96 v46.15,172.96 | 60.12,197.72 60.12,202.8 61.39,202.8 U$8.1 | 117.91,92.31 131.88,106.28 131.88,106.92 U$2.1 132.51,107.55 132.51,171.69 | 117.91,92.31 117.27,91.68 U$3.1 | 94.41,197.72 92.51,195.82 92.51,190.74 91.87,190.1 MS2.28 | 94.41,197.72 96.32,199.63 | 96.32,199.63 98.86,202.17 98.86,202.8 U$9.1 | 132.51,171.69 127.43,171.69 127.43,193.91 126.16,195.18 126.16,196.45 U$10.1 125.53,196.45 99.49,196.45 96.32,199.63 | 132.51,171.69 135.69,171.69 U$1.1 | 94.41,197.72 60.12,197.72 | 117.91,92.31 v117.27,92.95
  Bottom 0.508: 68.38,16.11 68.38,7.22 EDGE_CON.PIN31 | 68.38,16.11 98.22,16.11 102.03,19.92 v112.19,19.92 | v70.28,65.01 72.82,65.01 PROTOBOARD.28 73.46,65.64 100.76,92.95 v117.27,92.95 | v60.12,16.11 68.38,16.11 | v46.15,172.96 v27.1,172.96

### Text on the board
bPlace: PLACE LIPO BATTERY HERE | FEATHER 32u4 BLUEFRUIT | SPACE APPS TROPHY IS POWERED BY DEVICES MADE BY: | TROPHY DESIGNED AND ASSEMBLED BY ANDREW DENIO | (2016 GLOBAL SPACE APPS WINNER FOR PROJECT 'FRACTALNET') | FOR ASSEMBLY INSTRUCTIONS AND A DESCRIPTION OF THIS TROPHY, PLEASE VISIT: https://github.com/ExpeditionSTEM/2019SpaceAppsTrophy | Components Used: Custom-made Printed Circuit Board with ENIG Finish, Feather 32u4 Bluefruit LE, Monochrome eInk FeatherWing, | Light Sensor, Neopixels, Lithium Ion Polymer Battery, Prototype FeatherWing, 6mm Tactile Buttons, Slide Switch, Capacitors, Resistors | TROPHY AWARDED TO TEAM/PROJECT: | NEOPIXEL | 3.3V | GND | DATA OUT | ON | OFF